# Altium schematic sheet Lasersch.SchDoc
size A3; SheetNumber: 1; SheetTotal: 1
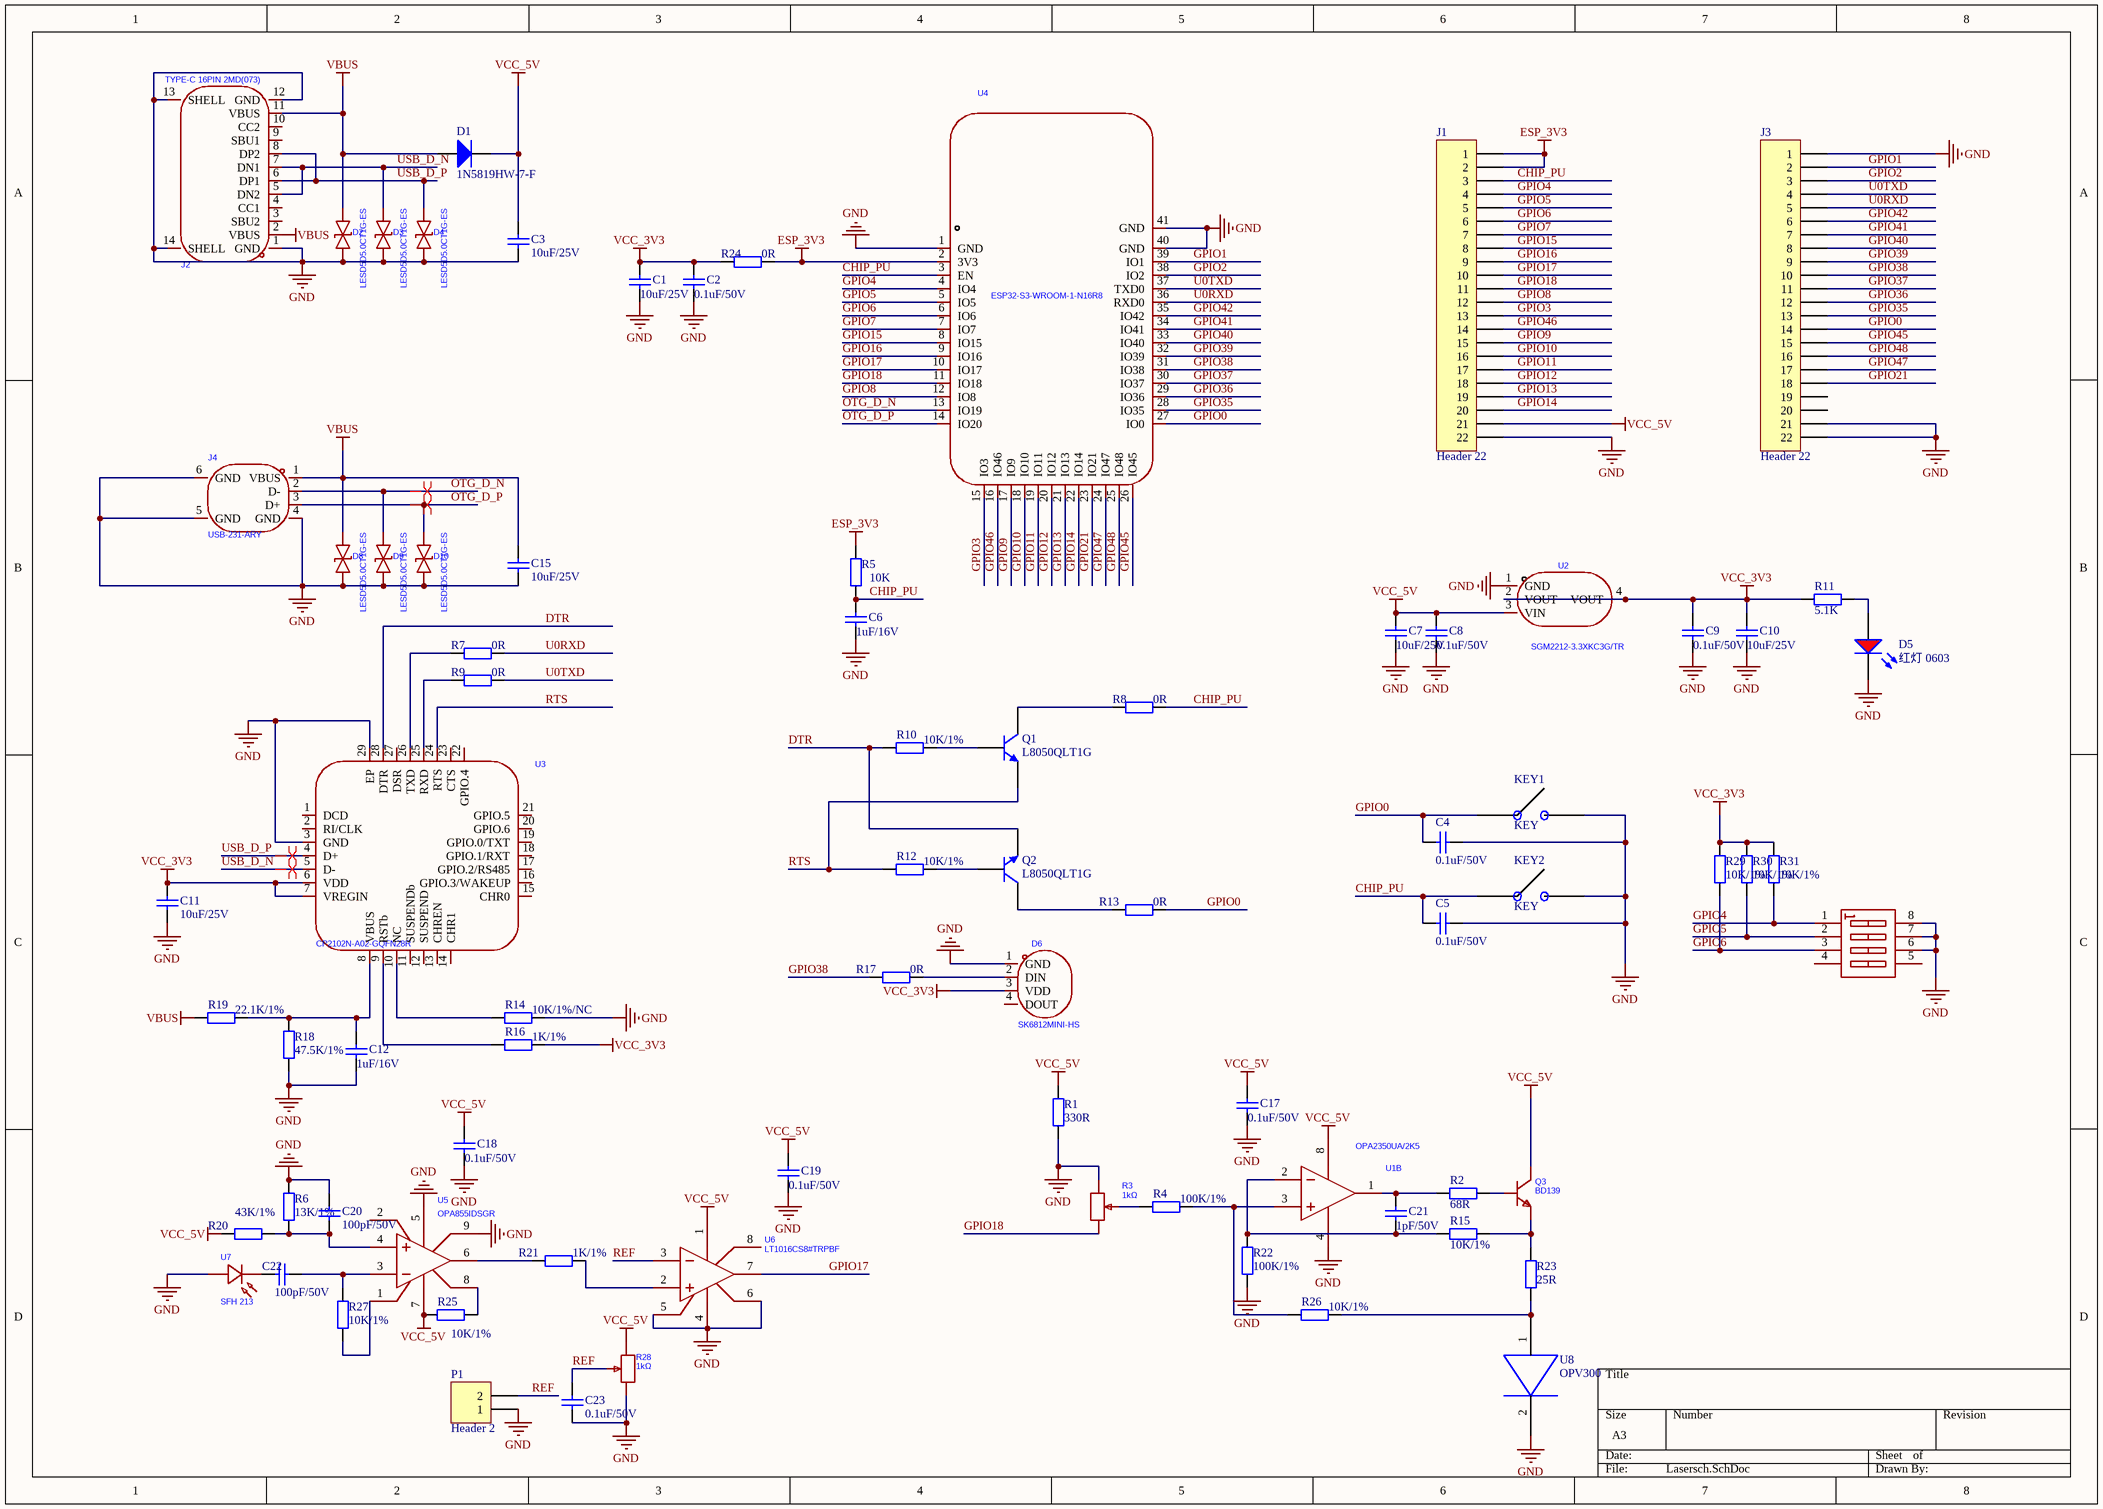
[diagram p0: Lasersch.SchDoc]

## Parts
C1  10uF/25V  [0805_C]
C2  0.1uF/50V  [0603_C]
C3  10uF/25V  [0805_C]
C4  0.1uF/50V  [0603_C]
C5  0.1uF/50V  [0603_C]
C6  1uF/16V  [0603_C]
C7  10uF/25V  [0805_C]
C8  0.1uF/50V  [0603_C]
C9  0.1uF/50V  [0603_C]
C10  10uF/25V  [0805_C]
C11  10uF/25V  [0805_C]
C12  1uF/16V  [0603_C]
C15  10uF/25V  [0805_C]
C17  0.1uF/50V  [0603_C]
C18  0.1uF/50V  [0603_C]
C19  0.1uF/50V  [0603_C]
C20  100pF/50V  [0603_C]
C21  1pF/50V  [0603_C]
C22  100pF/50V  [0603_C]
C23  0.1uF/50V  [0603_C]
D1  1N5819HW-7-F  [SOD-123]
D2  LESD5D5.0CT1G-ES  [SOD-523_L1.2-W0.8-LS1.6-BI]
D3  LESD5D5.0CT1G-ES  [SOD-523_L1.2-W0.8-LS1.6-BI]
D4  LESD5D5.0CT1G-ES  [SOD-523_L1.2-W0.8-LS1.6-BI]
D5  红灯 0603  [0603_LED_S1]
D6  SK6812MINI-HS  [LED-SMD_4P-L3.5-W3.5-BR_SK6812MINI-HS]
D8  LESD5D5.0CT1G-ES  [SOD-523_L1.2-W0.8-LS1.6-BI]
D9  LESD5D5.0CT1G-ES  [SOD-523_L1.2-W0.8-LS1.6-BI]
D10  LESD5D5.0CT1G-ES  [SOD-523_L1.2-W0.8-LS1.6-BI]
J1  Header 22  [HDR1X22]
J2  TYPE-C 16PIN 2MD(073)  [USB-C-SMD_TYPE-C-6PIN-2MD-073]
J3  Header 22  [HDR1X22]
J4  USB-231-ARY  [USB-A-TH_USB-231-ARY]
KEY1  KEY  [SW-smt]
KEY2  KEY  [SW-smt]
P1  Header 2  [HDR1X2]
Q1  L8050QLT1G  [SOT-23(SOT-23-3)]
Q2  L8050QLT1G  [SOT-23(SOT-23-3)]
Q3  BD139  [TO-126_L7.5-W2.5-P2.3-B]
R1  330R  [0603_R]
R2  68R  [0603_R]
R3  1kΩ  [RES-ADJ-TH_3296W]
R4  100K/1%  [0603_R]
R5  10K  [0603_R]
R6  13K/1%  [0603_R]
R7  0R  [0603_R]
R8  0R  [0603_R]
R9  0R  [0603_R]
R10  10K/1%  [0603_R]
R11  5.1K  [0603_R]
R12  10K/1%  [0603_R]
R13  0R  [0603_R]
R14  10K/1%/NC  [0603_R]
R15  10K/1%  [0603_R]
R16  1K/1%  [0603_R]
R17  0R  [0603_R]
R18  47.5K/1%  [0603_R]
R19  22.1K/1%  [0603_R]
R20  43K/1%  [0603_R]
R21  1K/1%  [0603_R]
R22  100K/1%  [0603_R]
R23  25R  [0603_R]
R24  0R  [0603_R]
R25  10K/1%  [0603_R]
R26  10K/1%  [0603_R]
R27  10K/1%  [0603_R]
R28  1kΩ  [RES-ADJ-TH_3296W]
R29  10K/1%  [0603_R]
R30  10K/1%  [0603_R]
R31  10K/1%  [0603_R]
U1  OPA2350UA/2K5  [SOIC-8_L4.9-W3.9-P1.27-LS6.0-BL]  (part B of 2)
U2  SGM2212-3.3XKC3G/TR  [SOT-223-3_L6.5-W3.4-P2.30-LS7.0-BR]
U3  CP2102N-A02-GQFN28R  [QFN-28_L5.0-W5.0-P0.50-TL-EP3.3]
U4  ESP32-S3-WROOM-1-N16R8  [WIRELM-SMD_ESP32-S3-WROOM-1]
U5  OPA855IDSGR  [DFN-8_L2.0-W2.0-P0.50-BL-EP]
U6  LT1016CS8#TRPBF  [SO-8_L4.9-W3.9-P1.27-LS5.9-BL]
U7  SFH 213  [LED-TH_BD5.8-P2.54-RD]
U8  OPV300  [OPV300]
U9  BX-DS2.54-4PTP  [SW-SMD_8P-L10.3-W6.2-P2.54-LS9.5-BL]  (value not drawn)

## Nets
ESP_3V3: J1.1 J1.2 R5.2 R24.2 U4.2(3V3)
GND: C1.1 C2.1 C3.1 C4.1 C5.1 C6.1 C7.1 C8.1 C9.1 C10.1 C11.1 C12.1 C15.1 C17.1 C18.1 C19.1 C20.1 C23.2 D2.1 D3.1 D4.1 D5.K D6.1(GND) D8.1 D9.1 D10.1 J1.22 J2.1(GND) J2.12(GND) J2.13(SHELL) J2.14(SHELL) J3.1 J3.21 J3.22 J4.4(GND) J4.5(GND) J4.6(GND) KEY1.2 KEY2.2 P1.1 R1.1 R3.3 R6.2 R14.2 R18.1 R22.2 R28.3 U1.4(V-) U2.1(GND) U3.3(GND) U3.29(EP) U4.1(GND) U4.40(GND) U4.41(GND) U5.5(V-) U5.9(EP) U6.4(V-) U6.5(LATCH_ENABLE) U6.6(GND) U7.2(A) U8.2 U9.6 U9.7 U9.8
VBUS: C15.2 D1.1(A) D2.2 D8.2 J2.2(VBUS) J2.11(VBUS) J4.1(VBUS) R19.1
VCC_3V3: C1.2 C2.2 C9.2 C10.2 C11.2 D6.3(VDD) R11.2 R16.2 R24.1 R29.2 R30.2 R31.2 U2.2(VOUT) U2.4(VOUT) U3.6(VDD) U3.7(VREGIN)
VCC_5V: C3.2 C7.2 C8.2 C17.2 C18.2 C19.2 D1.2(K) J1.21 Q3.2(C) R1.2 R20.1 R25.1 R28.1 U1.8(V+) U2.3(VIN) U5.7(V+) U6.1(V+)
CHIP_PU: C5.2 C6.2 J1.3 KEY2.1 R5.1 R8.2 U4.3(EN)
DTR: Q2.2(E) R10.1 U3.28(DTR)
GPIO0: C4.2 J3.14 KEY1.1 R13.2 U4.27(IO0)
GPIO1: J3.2 U4.39(IO1)
GPIO2: J3.3 U4.38(IO2)
GPIO3: J1.13 U4.15(IO3)
GPIO4: J1.4 R31.1 U4.4(IO4) U9.1
GPIO5: J1.5 R30.1 U4.5(IO5) U9.2
GPIO6: J1.6 R29.1 U4.6(IO6) U9.3
GPIO7: J1.7 U4.7(IO7)
GPIO8: J1.12 U4.12(IO8)
GPIO9: J1.15 U4.17(IO9)
GPIO10: J1.16 U4.18(IO10)
GPIO11: J1.17 U4.19(IO11)
GPIO12: J1.18 U4.20(IO12)
GPIO13: J1.19 U4.21(IO13)
GPIO14: J1.20 U4.22(IO14)
GPIO15: J1.8 U4.8(IO15)
GPIO16: J1.9 U4.9(IO16)
GPIO17: J1.10 U4.10(IO17) U6.7(Q_OUT)
GPIO18: J1.11 R3.1 U4.11(IO18)
GPIO21: J3.18 U4.23(IO21)
GPIO35: J3.13 U4.28(IO35)
GPIO36: J3.12 U4.29(IO36)
GPIO37: J3.11 U4.30(IO37)
GPIO38: J3.10 R17.1 U4.31(IO38)
GPIO39: J3.9 U4.32(IO39)
GPIO40: J3.8 U4.33(IO40)
GPIO41: J3.7 U4.34(IO41)
GPIO42: J3.6 U4.35(IO42)
GPIO45: J3.15 U4.26(IO45)
GPIO46: J1.14 U4.16(IO46)
GPIO47: J3.17 U4.24(IO47)
GPIO48: J3.16 U4.25(IO48)
OTG_D_N: D9.2 J4.2(D-) U4.13(IO19)
OTG_D_P: D10.2 J4.3(D+) U4.14(IO20)
REF: C23.1 P1.2 R28.2 U6.3(IN-)
RTS: Q1.2(E) R12.1 U3.24(RTS)
U0RXD: J3.5 R7.2 U4.36(RXD0)
U0TXD: J3.4 R9.2 U4.37(TXD0)
USB_D_N: D3.2 J2.5(DN2) J2.7(DN1) U3.5(D-)
USB_D_P: D4.2 J2.6(DP1) J2.8(DP2) U3.4(D+)
NetC12_2: C12.2 R18.2 R19.2 U3.8(VBUS)
NetC20_2: C20.2 R6.1 R20.2 U5.4(IN+)
NetC21_1: C21.1 R15.2 R22.1 U1.2(IN_A-)
NetC21_2: C21.2 R2.2 U1.1(OUT_A)
NetC22_1: C22.1 R27.2 U5.3(IN-)
NetC22_2: C22.2 U7.1(K)
NetD5_A: D5.A R11.1
NetD6_2: D6.2(DIN) R17.2
NetQ1_1: Q1.1(B) R10.2
NetQ1_3: Q1.3(C) R8.1
NetQ2_1: Q2.1(B) R12.2
NetQ2_3: Q2.3(C) R13.1
NetQ3_1: Q3.1(B) R2.1
NetQ3_3: Q3.3(E) R15.1 R23.1
NetR3_2: R3.2 R4.1
NetR4_2: R4.2 R26.1 U1.3(IN_A+)
NetR7_1: R7.1 U3.26(TXD)
NetR9_1: R9.1 U3.25(RXD)
NetR14_1: R14.1 U3.10(NC)
NetR16_1: R16.1 U3.9(RSTb)
NetR21_1: R21.1 U5.6(VOUT)
NetR21_2: R21.2 U6.2(IN+)
NetR23_2: R23.2 R26.2 U8.1
NetR25_2: R25.2 U5.8(PD#)
NetR27_1: R27.1 U5.1(FB)

Not connected (* = marked no-connect by the designer): D6 4(DOUT); J2 3(SBU2) 4(CC1) 9(SBU1) 10(CC2); J3 19 20; U3 1(DCD) 2(RI/CLK) 11(SUSPENDb) 12(SUSPEND) 13(CHREN) 14(CHR1) 15(CHR0) 16(GPIO.3/WAKEUP) 17(GPIO.2/RS485) 18(GPIO.1/RXT) 19(GPIO.0/TXT) 20(GPIO.6) 21(GPIO.5) 22(GPIO.4) 23(CTS) 27(DSR); U5 2(NC); U6 8(Q_OUT#); U9 4 5

## Layout directives
differential pair: OTG_D_N, OTG_D_P, USB_D_N, USB_D_P

## Library data of the parts
C1 C3 C7 C10 C11 C15 = 0805 2.0pF (2R0) 0.25pF 50V: 贴片电容; ComponentLink1Description: 供应商链接; ComponentLink1URL: http://www.szlcsc.com/product/details_2152.html; Package: 0805; Supplier: LC; SuppliersPartNumber: C1800
C2 C4-C6 C8 C9 C12 C17-C23 = 0603 8.2nF (822) 10% 50V: 贴片电容; ComponentLink1Description: 供应商链接; ComponentLink1URL: http://www.szlcsc.com/product/details_28670.html; Package: 0603; Supplier: LC; SuppliersPartNumber: C27920
D1 = 1SS314: 射频开关二极管
D2-D4 D8-D10 = LESD5D5.0CT1G-ES: Manufacturer: ElecSuper(静芯微); Add into BOM: yes; polarity: 双向; Reverse Stand-Off Voltage (Vrwm): 5V; Maximum Clamping Voltage: 10V; Peak Pulse Current (Ipp): 8A; Peak Pulse Power Dissipation (Ppp): 80W; Breakdown Voltage: 5.8V; Reverse Leakage Current (Ir): 1uA; Number of Lines: 单路; Type: ESD; Symbol: LESD5D5.0CT1G-ES; Device: LESD5D5.0CT1G-ES; LCSC Part Name: 普容5.0V，单路双向ESD静电防护器件，30kV，CJ：12pF；音频/视频/通讯防护; Supplier Part: C5199159; Manufacturer Part: LESD5D5.0CT1G-ES; Supplier Footprint: SOD523; JLCPCB Part Class: Extended Part; Datasheet: https://atta.szlcsc.com/upload/public/pdf/source/20240905/10776531C4DE5F6ADA679023752259EC.pdf; Supplier: LCSC; Convert to PCB: yes; Operating Temperature: -
D5 = 0603 红灯: 发光二极管; ComponentLink1Description: 供应商链接; ComponentLink1URL: http://www.szlcsc.com/product/details_2659.html; Package: 0603; Supplier: LC; SuppliersPartNumber: C2286
D6 = SK6812MINI-HS: Manufacturer: 欧思科光电; Add into BOM: yes; Wavelength: R:620nm~625nm；B:465nm~475nm；G:520nm~530nm; Luminous Intensity: R:200mcd~385mcd；B:160mcd~320mcd；G:815mcd~1275mcd; Fixed-Frequency Pwm Mode: 1kHz; Data Transmission Rate: 800Kbit/s; Voltage - Supply: 3.7V~5.5V; Quiescent Current: 0.6mA; Lens Color: 半透明透镜; ESD Withstand Voltage: 2000V; Viewing Angle: 120°; Symbol: SK6812MINI-HS; Device: SK6812MINI-HS; LCSC Part Name: SK6812MINI-HS; Supplier Part: C2922787; Manufacturer Part: SK6812MINI-HS; Supplier Footprint: SMD,3.5x3.7mm; JLCPCB Part Class: Extended Part; Datasheet: https://item.szlcsc.com/datasheet/SK6812MINI-HS/3234155.html; Supplier: LCSC; Convert to PCB: yes; Operating Temperature: -40℃~+85℃; Length: 3.7mm; Width: 1.95mm; Height: 3.5mm
J1 J3 = Header 22: Header, 22-Pin; LatestRevisionDate: 17-Jul-2002; LatestRevisionNote: Re-released for DXP Platform.; Publisher: Altium Limited
J2 = TYPE-C 16PIN 2MD(073): Manufacturer: SHOU HAN(首韩); Add into BOM: yes; Gender: 母; Number of Contacts: 16P; Number of Ports: 1; Current Rating-Power: 3A; Voltage Rating: 5V; Connect-Disconnect Life: 5千次; Detection color: 黑色; Symbol: TYPE-C 16PIN 2MD(073); Device: TYPE-C 16PIN 2MD(073); LCSC Part Name: Type-C 母 卧贴; Supplier Part: C2765186; Manufacturer Part: TYPE-C 16PIN 2MD(073); Supplier Footprint: SMD; JLCPCB Part Class: Extended Part; Datasheet: https://item.szlcsc.com/datasheet/TYPE-C%252016PIN%25202MD(073)/2901843.html; Supplier: LCSC; Convert to PCB: yes; Connector Type: Type-C; Protocol Standard: -; Mounting Type: 卧贴; Supplementary Features: -; Center Height: -; Length: -; Operating Temperature: -25℃~+85℃
J4 = USB-231-ARY: Manufacturer: XUNPU(讯普); Add into BOM: yes; Connector Type: Type-A; Protocol Standard: USB 2.0; Gender: 母; Number of Contacts: 4P; Number of Ports: 1; Current Rating-Power: 1.5A; Voltage Rating: 30V; Detection color: 白色; Symbol: USB-231-ARY; Device: USB-231-ARY; LCSC Part Name: Type-A 母 弯插; Supplier Part: C720525; Manufacturer Part: USB-231-ARY; Supplier Footprint: 弯插; JLCPCB Part Class: Extended Part; Datasheet: https://item.szlcsc.com/datasheet/USB-231-ARY/763532.html; Supplier: LCSC; Convert to PCB: yes; Mounting Type: 弯插; Length: 14.2mm; Operating Temperature: -20℃~+70℃
KEY1 KEY2 = keysmt
P1 = Header 2: Header, 2-Pin; LatestRevisionDate: 17-Jul-2002; LatestRevisionNote: Re-released for DXP Platform.; Publisher: Altium Limited
Q1 Q2 = SOT-23 MMBT5551  G1: 三极管; ComponentLink1Description: 供应商链接; ComponentLink1URL: http://www.szlcsc.com/product/details_2502.html; Package: SOT-23; Supplier: LC; SuppliersPartNumber: C2145
Q3 = BD139: Manufacturer: ST(意法半导体); Add into BOM: yes; type: NPN; Current - Collector(Ic): 1.5A; Collector - Emitter Voltage VCEO: 80V; Pd - Power Dissipation: 12.5W; DC Current Gain: 63@150mA,2V; Current - Collector Cutoff: 10uA; Vce Saturation(VCE(sat)): 500mV@0.5A,0.05A; Emitter-Base Voltage(Vebo): 5V; Number: 1个NPN; Symbol: BD139; Device: BD139; LCSC Part Name: NPN 电流:1.5A 电压:80V; Supplier Part: C27866; Manufacturer Part: BD139; Supplier Footprint: TO-126; JLCPCB Part Class: Extended Part; Datasheet: https://item.szlcsc.com/datasheet/BD139/28616.html; Supplier: LCSC; Convert to PCB: yes; Operating Temperature: -65℃~+150℃
R1 R2 R4-R27 R29-R31 = 0603 1KΩ (1001) 1%: 贴片电阻; ComponentLink1Description: 供应商链接; ComponentLink1URL: http://www.szlcsc.com/product/details_21904.html; Package: 0603; Supplier: LC; SuppliersPartNumber: C21190
R3 R28 = 3296W-1-102LF: Manufacturer: BOURNS; Add into BOM: yes; Tolerance: ±10%; Power(Watts): 500mW; Temperature Coefficient: ±100ppm/℃; Number of Turns: 25; Symbol: 3296W-1-102LF; Device: 3296W-1-102LF; LCSC Part Name: 1kΩ ±10%; Supplier Part: C57089; Manufacturer Part: 3296W-1-102LF; Supplier Footprint: SIP-3P,9.5x4.8mm; JLCPCB Part Class: Extended Part; Datasheet: https://item.szlcsc.com/datasheet/3296W-1-102LF/58119.html; Supplier: LCSC; Convert to PCB: yes; Value: 1kΩ
U1 = OPA2350UA/2K5: Manufacturer: TI(德州仪器); Add into BOM: yes; Number of Channels: 双路; Gain Bandwidth Product: 38MHz; Ib - Input Bias Current: 0.5pA; Slew Rate: 22V/us; Voltage - Supply: 2.5V~5.5V; Output Current: 40mA; Quiescent Current per Amplifier: 5.2mA; Symbol: OPA2350UA/2K5; Device: OPA2350UA/2K5; LCSC Part Name: OPA2350UA/2K5; Supplier Part: C55904; Manufacturer Part: OPA2350UA/2K5; Supplier Footprint: SOIC-8; JLCPCB Part Class: Extended Part; Datasheet: https://www.ti.com/cn/lit/gpn/opa2350; Supplier: LCSC; Convert to PCB: yes; Output Type: -; Rail to Rail: -; Operating Temperature: -40℃~+85℃
U2 = SGM2212-3.3XKC3G/TR_C3294699: Manufacturer: SGMICRO(圣邦微); Add into BOM: yes; Output Type: 固定; Voltage - Supply: 20V; Output Voltage: 3.3V; Output Current: 800mA; Power Supply Rejection Ratio (PSRR): 80dB@(120Hz); Voltage Dropout: 450mV@(800mA); standby current: 80uA; Noise: 0.002%Vout; Symbol: SGM2212-3.3XKC3G/TR_C3294699; Device: SGM2212-3.3XKC3G/TR_C3294699; LCSC Part Name: SGM2212-3.3XKC3G/TR; Supplier Part: C3294699; Manufacturer Part: SGM2212-3.3XKC3G/TR; Supplier Footprint: SOT-223-3; JLCPCB Part Class: Extended Part; Datasheet: https://item.szlcsc.com/datasheet/SGM2212-3.3XKC3G%252FTR/3859121.html; Supplier: LCSC; Convert to PCB: yes; Features: 短路保护；热关断; Operating Temperature: -40℃~+125℃
U3 = CP2102N-A02-GQFN28R: Manufacturer: SKYWORKS/SILICON LABS(芯科); Add into BOM: yes; Applications Function: USB转UART; USB Protocol: USB 2.0; Voltage - Supply: 3V~3.6V; Current - Supply: 9.5mA; Supply Current (Iq): 1.3uA; Symbol: CP2102N-A02-GQFN28R; Device: CP2102N-A02-GQFN28R; LCSC Part Name: CP2102N-A02-GQFN28R; Supplier Part: C964632; Manufacturer Part: CP2102N-A02-GQFN28R; Supplier Footprint: QFN-28-EP(5x5); JLCPCB Part Class: Extended Part; Datasheet: https://item.szlcsc.com/datasheet/CP2102N-A02-GQFN28R/1049893.html; Supplier: LCSC; Convert to PCB: yes; Operating Temperature: -40℃~+85℃@(Ta)
U4 = ESP32-S3-WROOM-1-N16R8: Manufacturer: ESPRESSIF(乐鑫); Symbol: ESP32-S3-WROOM-1(N16R8); Add into BOM: yes; Device: ESP32-S3-WROOM-1-N16R8; LCSC Part Name: 通用型Wi-Fi+低功耗蓝牙MCU模组; Supplier Part: C2913202; Manufacturer Part: ESP32-S3-WROOM-1-N16R8; Supplier Footprint: SMD,18x25.5mm; JLCPCB Part Class: Extended Part; Datasheet: https://item.szlcsc.com/datasheet/ESP32-S3-WROOM-1-N16R8/3198300.html; Supplier: LCSC; Convert to PCB: yes
U5 = OPA855IDSGR: Manufacturer: TI(德州仪器); Add into BOM: yes; Number of Channels: 单路; Maximum Power Supply Range (Vdd-Vss): 5.25V; Gain Bandwidth Product: 8GHz; Vos - Input Offset Voltage: 200uV; Input Offset Voltage Drift(Vos TC): 1.5uV/℃; Slew Rate: 2.75V/ns; Ib - Input Bias Current: 18.5uA; Input Offset Current(Ios): 100nA; Noise density(eN): 980pV/√Hz@1kHz; Common Mode Rejection Ratio(CMRR): 100dB; Quiescent Current: 17.8mA; Output Current: 105mA; Single supply: 3.3V~5.25V; Symbol: OPA855IDSGR; Device: OPA855IDSGR; LCSC Part Name: 8GHz增益带宽积、7VV稳定增益、双极输入放大器; Supplier Part: C1409030; Manufacturer Part: OPA855IDSGR; Supplier Footprint: WSON-8-EP(2x2); JLCPCB Part Class: Extended Part; Datasheet: https://www.ti.com/cn/lit/gpn/opa855; Supplier: LCSC; Convert to PCB: yes; Rail to Rail: -; Input offset current drift(Ios TC): -; Operating Temperature: -40℃~+125℃; Dual Supply: -
U6 = LT1016CS8#TRPBF: Manufacturer: ADI(亚德诺); Add into BOM: yes; Vos - Input Offset Voltage: 3mV; Common Mode Rejection Ratio(CMRR): 96dB; Output Type: TTL；CMOS; Symbol: LT1016CS8#TRPBF; Device: LT1016CS8#TRPBF; LCSC Part Name: 超快精准 10ns 比较器; Supplier Part: C661508; Manufacturer Part: LT1016CS8#TRPBF; Supplier Footprint: SO-8; JLCPCB Part Class: Extended Part; Datasheet: https://atta.szlcsc.com/upload/public/pdf/source/20200628/C661960_9C87D689D7FCCFB056AF2682BEAB8545.pdf; Supplier: LCSC; Convert to PCB: yes; Ib - Input Bias Current: -; Input Hysteresis Voltage (Vhys): -; Operating Temperature: 0℃~+70℃
U7 = SFH 213: Manufacturer: OSRAM(欧司朗); Add into BOM: yes; DC Reverse Voltage: 50V; Peak  Wavelength: 850nm; Spectral Range: 400nm~1100nm; Current Dark: 1nA; Symbol: SFH 213; Device: SFH 213; LCSC Part Name: 光电二极管; Supplier Part: C2900210; Manufacturer Part: SFH 213; Supplier Footprint: 插件; JLCPCB Part Class: Extended Part; Supplier: LCSC; Convert to PCB: yes; Reception Angle: -; Operating Temperature: -40℃~+100℃
U9 = BX-DS2.54-4PTP: Manufacturer: Bossie(博锡); Add into BOM: yes; Circuit: 单刀单掷; Number of Positions: 4位; Current Rating: 25mA; Voltage Rating: 24V; Operating Life: 3千次; Symbol: BX-DS2.54-4PTP; Device: BX-DS2.54-4PTP; LCSC Part Name: DSIC 2.54贴片高推4位 间距2.54mm 平拨 凹槽式 4位拨码开关; Supplier Part: C18078244; Manufacturer Part: BX-DS2.54-4PTP; Supplier Footprint: SMD,P=2.54mm; JLCPCB Part Class: Extended Part; Datasheet: https://item.szlcsc.com/datasheet/BX-DS2.54-4PTP/19218645.html; Supplier: LCSC; Convert to PCB: yes; Type: 平拨,凹槽式; Termination Style: -; Lead Pitch: 2.54mm; Operating Temperature: -30℃~+85℃; Color: 黑色